# Altium schematic sheet USBC.SchDoc
size A4; SheetNumber: 4; SheetTotal: 4
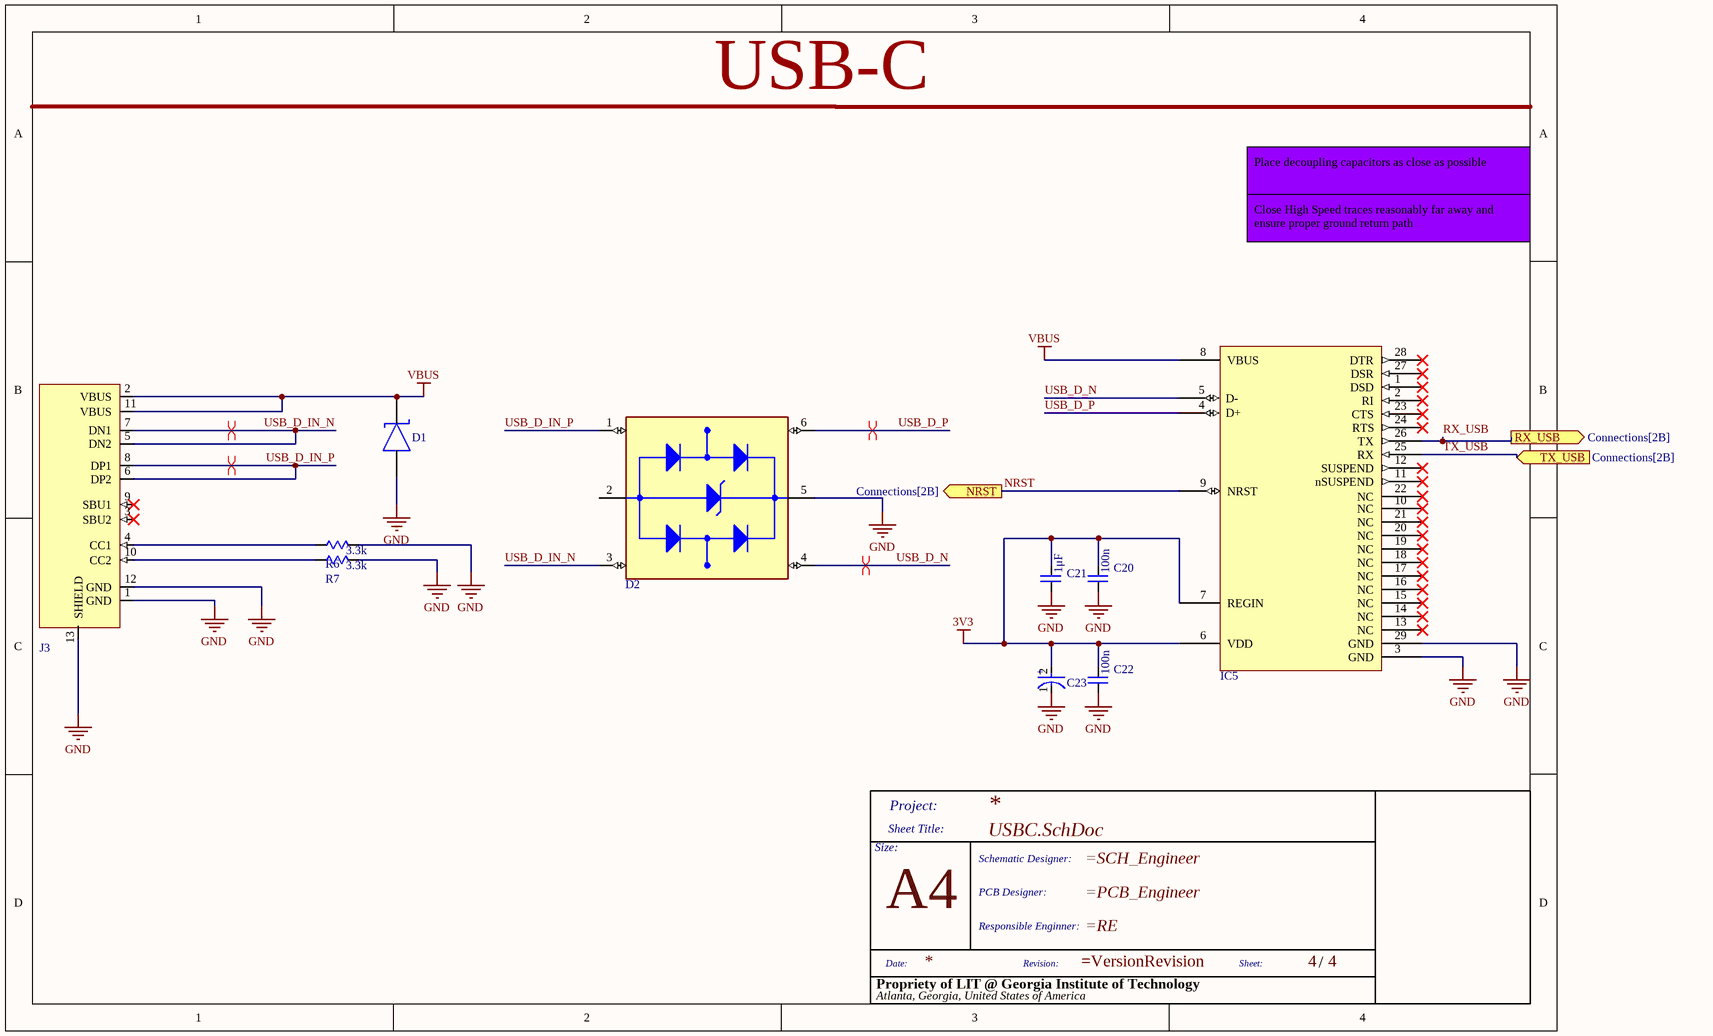
[diagram p0: USBC.SchDoc]

## Parts
*  Size: A4  (hidden comment: TitleBlock)  (graphical)
C20  KGM21NR71E104KT  [0805-RES]  (value not drawn)
C21  C0603C105Z8VAC7867  [0603-CAP]  (value not drawn)
C22  KGM21NR71E104KT  [0805-RES]  (value not drawn)
C23  865080640004  [865080640004]  (value not drawn)
D1  PESD5V0X1UB,135  [PESD5V0X1UB,135]  (value not drawn)
D2  USBLC6-2SC6  [SOT95P280X145-6N]  (value not drawn)
IC5  CP2102-GMR  [28-VFQFN]  (value not drawn)
J3  USB4105-GF-A  [USB4105-GF-A]  (value not drawn)
R6  ERA-3AEB332V  [0603-RES]  (value not drawn)
R7  ERA-3AEB332V  [0603-RES]  (value not drawn)

## Ports
NRST (out, see Connections[2B]), RX_USB (out, see Connections[2B]), TX_USB (in, see Connections[2B])

## Nets
3V3: C20.2 C21.2 C22.2 C23.2(A) IC5.6(VDD) IC5.7(REGIN)
GND: C20.1 C21.1 C22.1 C23.1(C) D1.1 D2.5(VBUS) IC5.3(GND) IC5.29(GND) J3.1(GND) J3.12(GND) J3.13(SHIELD) R6.2 R7.2
VBUS: D1.2 IC5.8(VBUS) J3.2(VBUS) J3.11(VBUS)
NRST: IC5.9(NRST) ; port NRST
RX_USB: IC5.26(TX) ; port RX_USB
TX_USB: IC5.25(RX) ; port TX_USB
USB_D_IN_N: D2.3(I/O2_IN) J3.5(DN2) J3.7(DN1)
USB_D_IN_P: D2.1(I/O1_IN) J3.6(DP2) J3.8(DP1)
USB_D_N: D2.4(I/O2_OUT) IC5.5(D-)
USB_D_P: D2.6(I/O1_OUT) IC5.4(D+)
NetJ3_4: J3.4(CC1) R6.1
NetJ3_10: J3.10(CC2) R7.1

Not connected (* = marked no-connect by the designer): D2 2(GND); IC5 1(DSD)* 2(RI)* 10(NC)* 11(nSUSPEND)* 12(SUSPEND)* 13(NC)* 14(NC)* 15(NC)* 16(NC)* 17(NC)* 18(NC)* 19(NC)* 20(NC)* 21(NC)* 22(NC)* 23(CTS)* 24(RTS)* 27(DSR)* 28(DTR)*; J3 3(SBU2)* 9(SBU1)*

## Layout directives
differential pair; differential pair class USB_IN: USB_D_IN_N, USB_D_IN_P
differential pair; differential pair class USB: USB_D_N, USB_D_P

## Notes on the sheet
- USB-C
- Close High Speed traces reasonably far away and ensure proper ground return path
- Place decoupling capacitors as close as possible
- (in symbol CAP-0603-10V-1uF) 1μF
- (in symbol CAP-0805-25V-100n) 100n
- (in symbol CAP-RADIALSMD-4.7uF(BIAS)) +
- (in symbol RES-0603-3.3k) 3.3k
- (in symbol TitleBlock) Project:; Sheet Title:; Size:; Schematic Designer:; PCB Designer:; Responsible Enginner:; Date:; Revision:; Sheet:; /; Propriety of LIT @ Georgia Institute of Technology; Atlanta, Georgia, United States of America

## Library data of the parts
* = TitleBlock: Standard Title Block
C20 C22 = CAP-0805-25V-100n: 0.1 µF ±10% 25V Ceramic Capacitor X7R 0805 (2012 Metric)
C21 = CAP-0603-10V-1uF: 1 µF -20%, +80% 10V Ceramic Capacitor Y5V (F) 0603 (1608 Metric)
C23 = CAP-RADIALSMD-4.7uF(BIAS): 4.7 µF 50 V Aluminum Electrolytic Capacitors Radial, Can - SMD 2000 Hrs @ 105°C
D1 = TVS-8V-5.8V: 8V (Typ) Clamp 1.5A (8/20µs) Ipp Tvs Diode Surface Mount SOD-523; pin to pad: 1>2 2>1
D2 = TVS-6V-17V: 17V Clamp 5A (8/20µs) Ipp Tvs Diode Surface Mount SOT-23-6; pin to pad: 4>6 6>4
IC5 = USbtoUART: USB Bridge, USB to UART USB 2.0 UART Interface 28-QFN (5x5); Manufacturer: Silicon Labs; Part number: CP2102-GMR
J3 = USB C: USB-C (USB TYPE-C) USB 2.0 Receptacle Connector 24 (16+8 Dummy) Position Surface Mount, Right Angle; Through Hole; pin to pad: 13>13+14+15+16; Manufacturer: GCT; Part number: USB4105-GF-A
R6 R7 = RES-0603-3.3k: 3.3 kOhms ±0.1% 0.1W, 1/10W Chip Resistor 0603 (1608 Metric) Automotive AEC-Q200 Thin Film; Manufacturer: Panasonic Electronic Components; Part number: ERA-3AEB332V